# EAGLE design esp32_programmer (EAGLE 9.6.2)

## Sheet 1 of 4
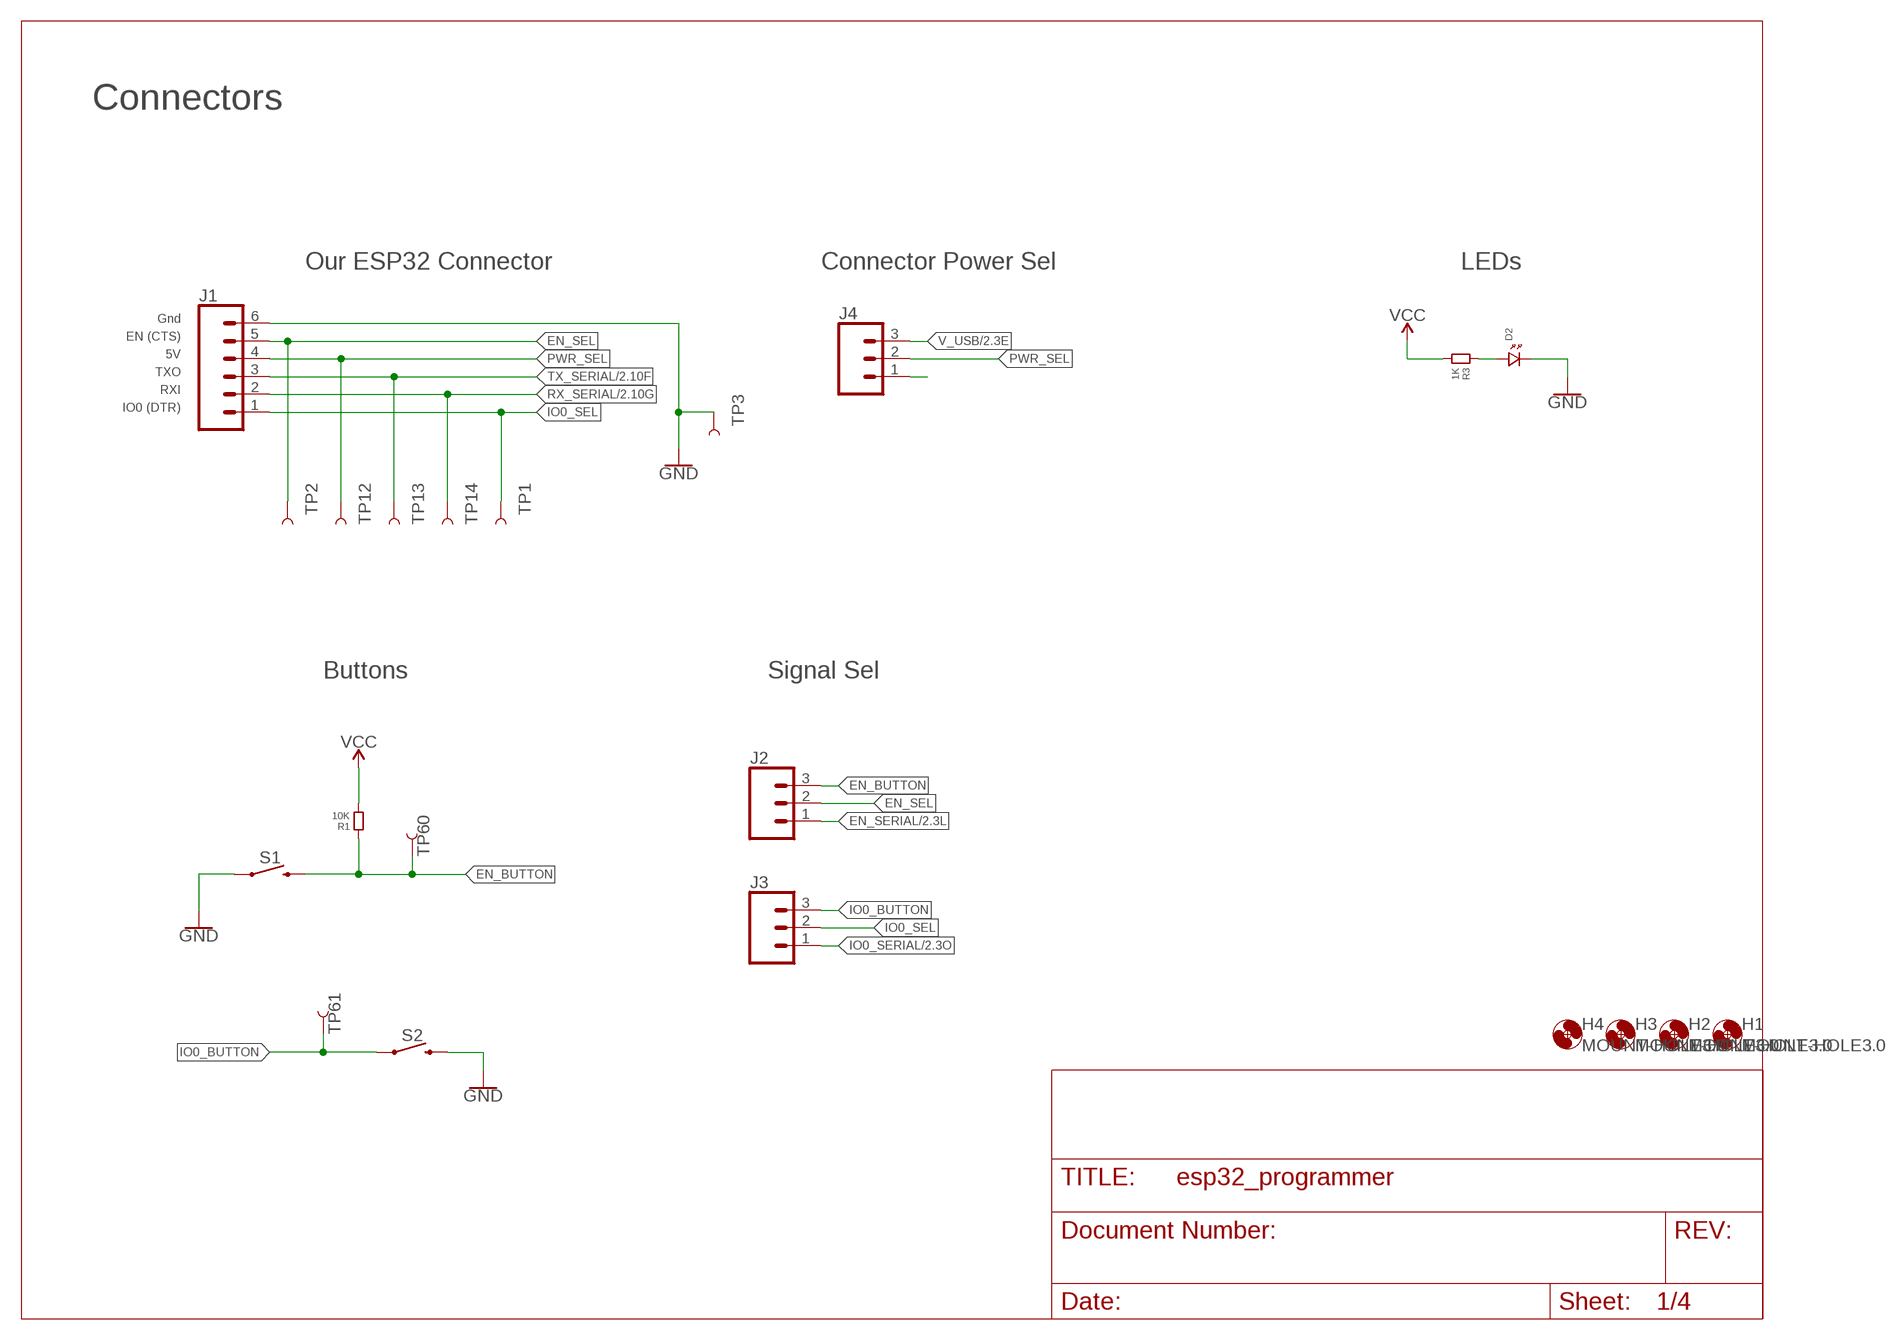
[diagram p0: schematic, sheet 1]

### Parts
D2  LED.1206  [1206.LED]
H1  MOUNT-HOLE3.0  [3,0]
H2  MOUNT-HOLE3.0  [3,0]
H3  MOUNT-HOLE3.0  [3,0]
H4  MOUNT-HOLE3.0  [3,0]
J1  CONN_06LONGPADS  [1X06_LONGPADS]
J2  CONN_03LONGPADS  [1X03_LONGPADS]
J3  CONN_03LONGPADS  [1X03_LONGPADS]
J4  CONN_03LONGPADS  [1X03_LONGPADS]
R1  10K  RESISTOR.1206  [1206]
R3  1K  RESISTOR.1206  [1206]
S1  MOMENTARY-SWITCH-SPST-SMD-5.2MM  [TACTILE_SWITCH_SMD_5.2MM]
S2  MOMENTARY-SWITCH-SPST-SMD-5.2MM  [TACTILE_SWITCH_SMD_5.2MM]
TP1  TEST-POINT3X5  [PAD.03X.05]
TP2  TEST-POINT3X5  [PAD.03X.05]
TP3  TEST-POINT3X5  [PAD.03X.05]
TP12  TEST-POINT3X5  [PAD.03X.05]
TP13  TEST-POINT3X5  [PAD.03X.05]
TP14  TEST-POINT3X5  [PAD.03X.05]
TP60  TEST-POINT3X5  [PAD.03X.05]
TP61  TEST-POINT3X5  [PAD.03X.05]

### Nets
EN_BUTTON: J2.3 R1.1 S1.3 TP60.P$1
EN_SEL: J1.5 J2.2 TP2.P$1
EN_SERIAL: J2.1 ; also sheet 2
GND: D2.P$2 J1.6 S1.1 S2.3 TP3.P$1 ; also sheet 2,3,4
IO0_BUTTON: J3.3 S2.1 TP61.P$1
IO0_SEL: J1.1 J3.2 TP1.P$1
IO0_SERIAL: J3.1 ; also sheet 2
N$8: J4.1
N$9: D2.P$1 R3.1
PWR_SEL [power]: J1.4 J4.2 TP12.P$1
RX_SERIAL: J1.2 TP14.P$1 ; also sheet 2,4
TX_SERIAL: J1.3 TP13.P$1 ; also sheet 2,4
V_USB [power]: J4.3 ; also sheet 2,3
VCC [power]: R1.2 R3.2 ; also sheet 2,3,4

### Notes on the sheet
- Connectors
- Our ESP32 Connector | Connector Power Sel | LEDs
- Gnd
- EN (CTS)
- 5V
- TXO
- RXI
- IO0 (DTR)
- Buttons | Signal Sel

## Sheet 2 of 4
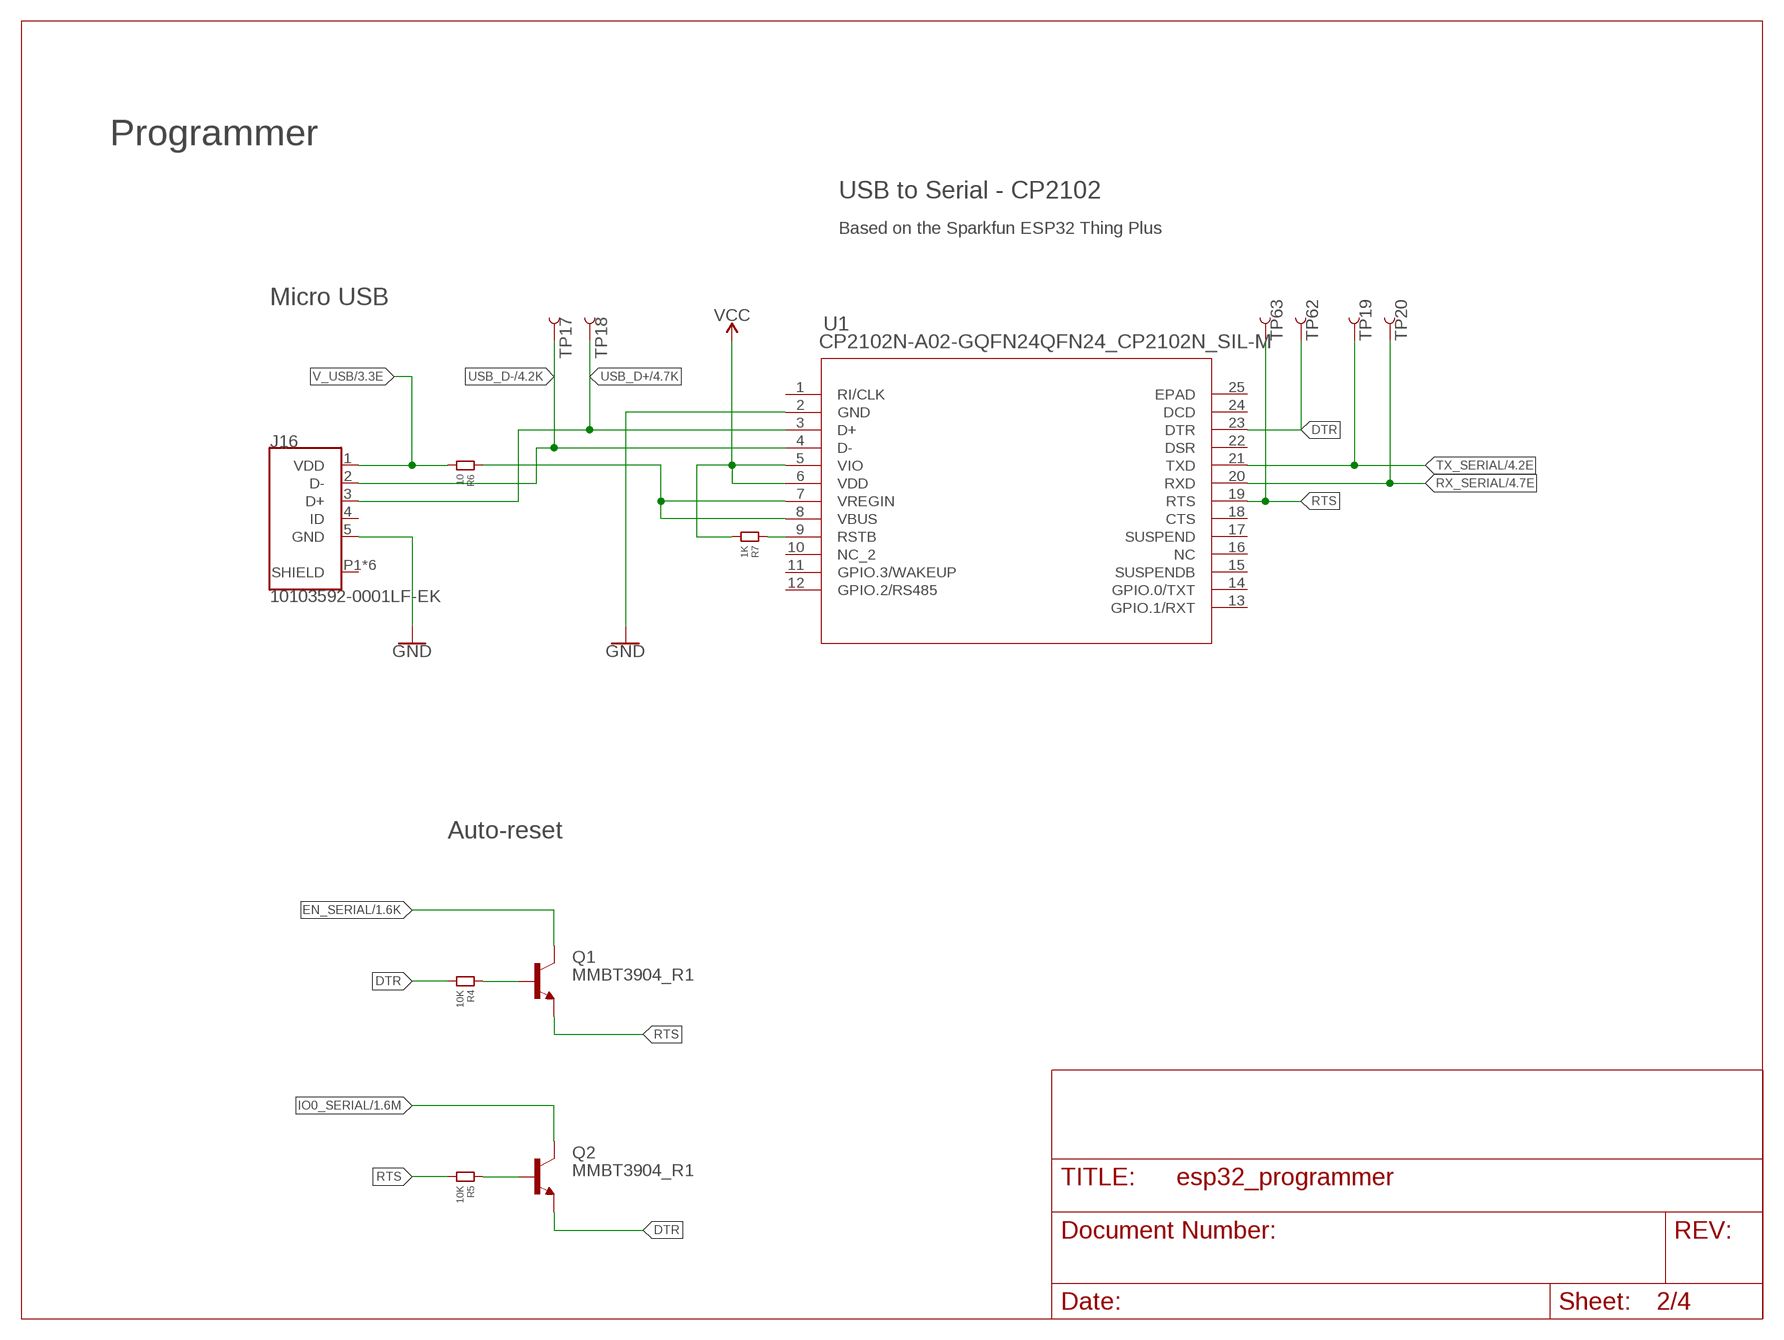
[diagram p1: schematic, sheet 2]

### Parts
J16  10103592-0001LF-EK  [AMPHENOL_10103592-0001LF]
Q1  MMBT3904_R1  BC846  [SOT23]
Q2  MMBT3904_R1  BC846  [SOT23]
R4  10K  RESISTOR.1206  [1206]
R5  10K  RESISTOR.1206  [1206]
R6  10  RESISTOR.1206  [1206]
R7  1K  RESISTOR.1206  [1206]
TP17  TEST-POINT3X5  [PAD.03X.05]
TP18  TEST-POINT3X5  [PAD.03X.05]
TP19  TEST-POINT3X5  [PAD.03X.05]
TP20  TEST-POINT3X5  [PAD.03X.05]
TP62  TEST-POINT3X5  [PAD.03X.05]
TP63  TEST-POINT3X5  [PAD.03X.05]
U1  CP2102N-A02-GQFN24QFN24_CP2102N_SIL-M  [QFN24_CP2102N_SIL-M]

### Nets
DTR: Q2.2(E) R4.2 TP62.P$1 U1.23(DTR)
EN_SERIAL: Q1.3(C) ; also sheet 1
GND: J16.5(GND) U1.2(GND) ; also sheet 1,3,4
IO0_SERIAL: Q2.3(C) ; also sheet 1
N$1: R6.1 U1.7(VREGIN) U1.8(VBUS)
N$10: Q1.1(B) R4.1
N$11: Q2.1(B) R5.1
N$12: R7.1 U1.9(RSTB)
RTS: Q1.2(E) R5.2 TP63.P$1 U1.19(RTS)
RX_SERIAL: TP20.P$1 U1.20(RXD) ; also sheet 1,4
TX_SERIAL: TP19.P$1 U1.21(TXD) ; also sheet 1,4
USB_D+: J16.3(D+) TP18.P$1 U1.3(D+) ; also sheet 4
USB_D-: J16.2(D-) TP17.P$1 U1.4(D-) ; also sheet 4
V_USB [power]: J16.1(VDD) R6.2 ; also sheet 1,3
VCC [power]: R7.2 U1.5(VIO) U1.6(VDD) ; also sheet 1,3,4
Unconnected: J16.4(ID) U1.1(RI/CLK) U1.10(NC_2) U1.11(GPIO.3/WAKEUP) U1.12(GPIO.2/RS485) U1.13(GPIO.1/RXT) U1.14(GPIO.0/TXT) U1.15(SUSPENDB) U1.16(NC) U1.17(SUSPEND) U1.18(CTS) U1.22(DSR) U1.24(DCD) U1.25(EPAD)

### Notes on the sheet
- Programmer
- USB to Serial - CP2102
- Based on the Sparkfun ESP32 Thing Plus
- Micro USB
- Auto-reset

## Sheet 3 of 4
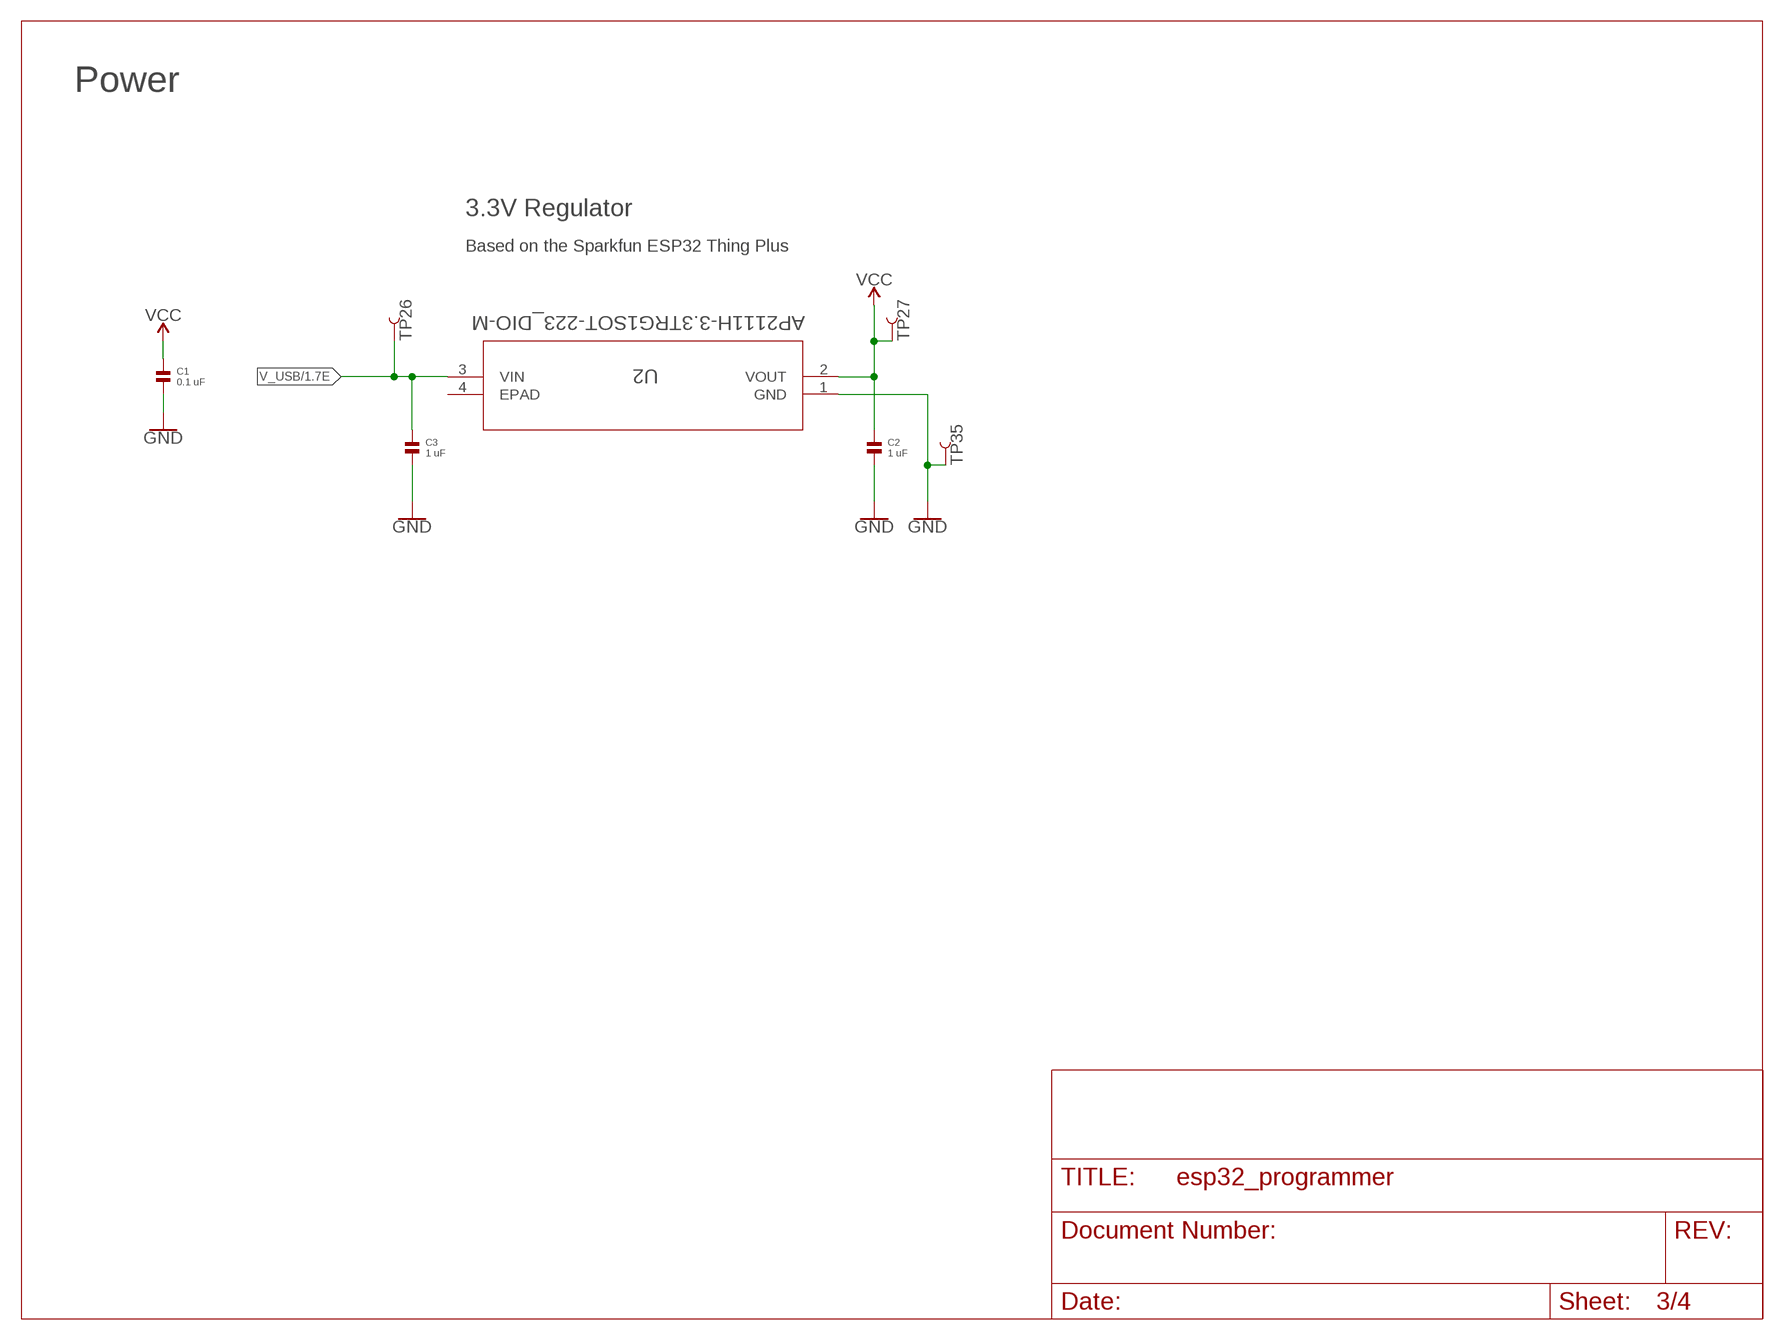
[diagram p2: schematic, sheet 3]

### Parts
C1  0.1 uF  CAPACITOR.1206  [1206]
C2  1 uF  CAPACITOR.1206  [1206]
C3  1 uF  CAPACITOR.1206  [1206]
TP26  TEST-POINT3X5  [PAD.03X.05]
TP27  TEST-POINT3X5  [PAD.03X.05]
TP35  TEST-POINT3X5  [PAD.03X.05]
U2  AP2111H-3.3TRG1SOT-223_DIO-M  [SOT-223_DIO-M]

### Nets
GND: C1.2 C2.2 C3.2 TP35.P$1 U2.1(GND) ; also sheet 1,2,4
V_USB [power]: C3.1 TP26.P$1 U2.3(VIN) ; also sheet 1,2
VCC [power]: C1.1 C2.1 TP27.P$1 U2.2(VOUT) ; also sheet 1,2,4
Unconnected: U2.4(EPAD)

### Notes on the sheet
- Power
- 3.3V Regulator
- Based on the Sparkfun ESP32 Thing Plus

## Sheet 4 of 4
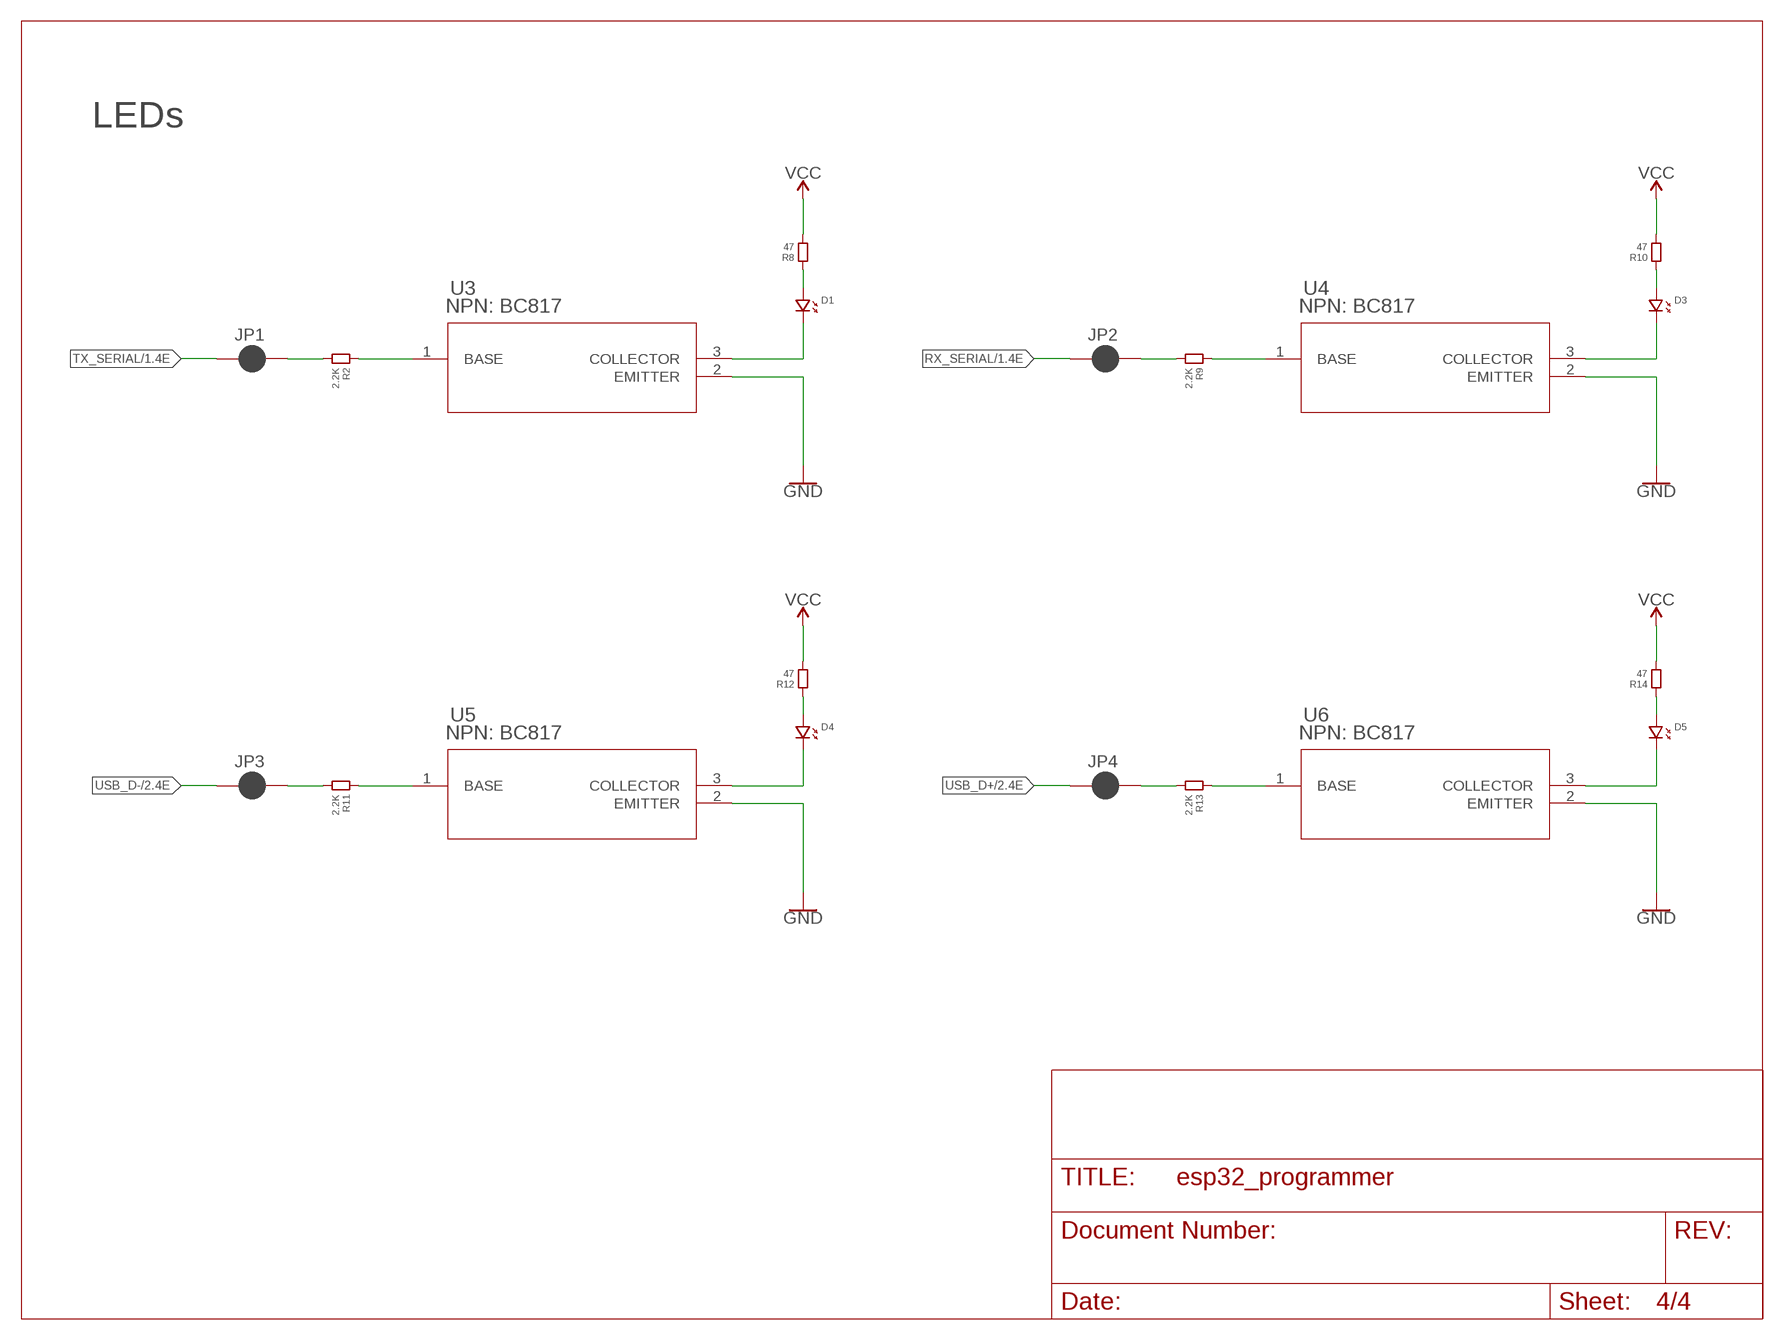
[diagram p3: schematic, sheet 4]

### Parts
D1  LED.1206  [1206.LED]
D3  LED.1206  [1206.LED]
D4  LED.1206  [1206.LED]
D5  LED.1206  [1206.LED]
JP1  JUMPER-SMT_2_NC_PASTE_SILK  [SMT-JUMPER_2_NC_PASTE_SILK]
JP2  JUMPER-SMT_2_NC_PASTE_SILK  [SMT-JUMPER_2_NC_PASTE_SILK]
JP3  JUMPER-SMT_2_NC_PASTE_SILK  [SMT-JUMPER_2_NC_PASTE_SILK]
JP4  JUMPER-SMT_2_NC_PASTE_SILK  [SMT-JUMPER_2_NC_PASTE_SILK]
R2  2.2K  RESISTOR.1206  [1206]
R8  47  RESISTOR.1206  [1206]
R9  2.2K  RESISTOR.1206  [1206]
R10  47  RESISTOR.1206  [1206]
R11  2.2K  RESISTOR.1206  [1206]
R12  47  RESISTOR.1206  [1206]
R13  2.2K  RESISTOR.1206  [1206]
R14  47  RESISTOR.1206  [1206]
U3  NPN: BC817  BC817-25LT3GSOT-23-3_1P4X3P040_ONS-M  [SOT-23-3_1P4X3P040_ONS-M]
U4  NPN: BC817  BC817-25LT3GSOT-23-3_1P4X3P040_ONS-M  [SOT-23-3_1P4X3P040_ONS-M]
U5  NPN: BC817  BC817-25LT3GSOT-23-3_1P4X3P040_ONS-M  [SOT-23-3_1P4X3P040_ONS-M]
U6  NPN: BC817  BC817-25LT3GSOT-23-3_1P4X3P040_ONS-M  [SOT-23-3_1P4X3P040_ONS-M]

### Nets
BLEP1: D4.P$2 U5.3(COLLECTOR)
BLEP2: D5.P$2 U6.3(COLLECTOR)
BLEP3: D1.P$2 U3.3(COLLECTOR)
BLEP4: D3.P$2 U4.3(COLLECTOR)
GND: U3.2(EMITTER) U4.2(EMITTER) U5.2(EMITTER) U6.2(EMITTER) ; also sheet 1,2,3
N$4: JP1.2 R2.2
N$7: JP2.2 R9.2
N$13: R2.1 U3.1(BASE)
N$14: D1.P$1 R8.1
N$15: R9.1 U4.1(BASE)
N$16: D3.P$1 R10.1
N$17: JP3.2 R11.2
N$18: R11.1 U5.1(BASE)
N$19: D4.P$1 R12.1
N$20: JP4.2 R13.2
N$21: R13.1 U6.1(BASE)
N$22: D5.P$1 R14.1
RX_SERIAL: JP2.1 ; also sheet 1,2
TX_SERIAL: JP1.1 ; also sheet 1,2
USB_D+: JP4.1 ; also sheet 2
USB_D-: JP3.1 ; also sheet 2
VCC [power]: R8.2 R10.2 R12.2 R14.2 ; also sheet 1,2,3

### Notes on the sheet
- LEDs

## Power pins joined to a net without a drawn wire
SHIELD: J16.P1(SHIELD) J16.P2(SHIELD) J16.P3(SHIELD) J16.P4(SHIELD) J16.P5(SHIELD) J16.P6(SHIELD)

## Library data of the parts
C1-C3 = standardparts:CAPACITOR
D1-D5 = standardparts:LED
H1-H4 = holes:MOUNT-HOLE: MOUNTING HOLE with drill center marker
J1 = zzzzSparkFun-Connectors:CONN_06: Multi connection point. Often used as Generic Header-pin footprint for 0.1 inch spaced/style header connections On any of the 0.1 inch spaced packages, you can populate with these: Break Away Headers - Straight <https://www.sparkfun.com/products/116> (PRT-00116) Break Away Male Headers - Right Angle <https://www.sparkfun.com/products/553> (PRT-00553) Female Headers <https://www.sparkfun.com/products/115> (PRT-00115) Break Away Headers - Machine Pin <https://www.sparkfun.com/products/117> (PRT-00117) Break Away Female Headers - Swiss Machine Pin <https://www.sparkfun.com/products/743> (PRT-00743) Arduino Stackable Header - 6 Pin <https://www.sparkfun.com/products/9280> (PRT-09280) For SCREWTERMINALS and SPRING TERMINALS visit here: Screw Terimnals on SparkFun.com <https://www.sparkfun.com/search/results?term=Screw+Terminals> (5mm/3.5mm/2.54mm spacing) This device is also useful as a general connection point to wire up your design to another part of your project. Our various solder wires solder well into these plated through hole pads. Hook-Up Wire - Assortment (Stranded, 22 AWG) <https://www.sparkfun.com/products/11375> (PRT-11375) Hook-Up Wire - Assortment (Solid Core, 22 AWG) <https://www.sparkfun.com/products/11367> (PRT-11367) View the entire wire category on our website here <https://www.sparkfun.com/categories/141>
J2-J4 = SparkFun-Connectors:CONN_03: Multi connection point. Often used as Generic Header-pin footprint for 0.1 inch spaced/style header connections On any of the 0.1 inch spaced packages, you can populate with these: Break Away Headers - Straight <https://www.sparkfun.com/products/116> (PRT-00116) Break Away Male Headers - Right Angle <https://www.sparkfun.com/products/553> (PRT-00553) Female Headers <https://www.sparkfun.com/products/115> (PRT-00115) Break Away Headers - Machine Pin <https://www.sparkfun.com/products/117> (PRT-00117) Break Away Female Headers - Swiss Machine Pin <https://www.sparkfun.com/products/743> (PRT-00743) Stackable Header - 3 Pin (Female, 0.1") <https://www.sparkfun.com/products/13875> (PRT-13875) For SCREWTERMINALS and SPRING TERMINALS visit here: Screw Terimnals on SparkFun.com <https://www.sparkfun.com/search/results?term=Screw+Terminals> (5mm/3.5mm/2.54mm spacing) This device is also useful as a general connection point to wire up your design to another part of your project. Our various solder wires solder well into these plated through hole pads. Hook-Up Wire - Assortment (Stranded, 22 AWG) <https://www.sparkfun.com/products/11375> (PRT-11375) Hook-Up Wire - Assortment (Solid Core, 22 AWG) <https://www.sparkfun.com/products/11367> (PRT-11367) View the entire wire category on our website here <https://www.sparkfun.com/categories/141> Special notes: Molex polarized connector foot print use with SKU : PRT-08232 with associated crimp pins and housings.
J16 = UltraLibrarianParts:10103592-0001LF-EK: Conn Micro USB Type B RCP 5 POS 0.65mm Solder RA SMD 5 Terminal 1 Port T/R; ARROW_ELECTRONICS-PURCHASE-URL: https://snapeda.com/shop?store=Arrow+Electronics&id=1274744; DESCRIPTION: USB - micro B USB 2.0 Receptacle Connector 5 Position Surface Mount, Right Angle; Through Hole; DIGI-KEY_PART_NUMBER: 609-4048-1-ND; DIGIKEY-PURCHASE-URL: https://snapeda.com/shop?store=DigiKey&id=1274744; MF: Amphenol ICC; MOUSER-PURCHASE-URL: https://snapeda.com/shop?store=Mouser&id=1274744; MP: 10103592-0001LF; PACKAGE: None
JP1-JP4 = SparkFun-Jumpers:JUMPER-SMT_2_NC_PASTE: Normally closed solder jumper This jumper has an aperture in the stencil to allow solder paste to bridge the split in the wire so it's normally closed (NC). Wick off the solder to open the connection. Reapply solder to reclose the connection.
Q1 Q2 = BC846:BC846: NPN TRANSISTOR Check availability <https://pricing.snapeda.com/parts/BC846/Rectron/view-part?ref=eda>; AVAILABILITY: In Stock; DESCRIPTION: Trans GP BJT NPN 65V 0.1A 3-Pin SOT-23; MF: Rectron; MP: BC846; PACKAGE: SOT-23-3 Rectron; PRICE: None
R1-R14 = standardparts:RESISTOR
S1 S2 = SparkFun-Switches:MOMENTARY-SWITCH-SPST: Momentary Switch (Pushbutton) - SPST Normally-open (NO) SPST momentary switches (buttons, pushbuttons). Variants PTH-12MM - 12mm square, through-hole Momentary Pushbutton Switch - 12mm Square <https://www.sparkfun.com/products/9190> (COM-09190) PTH-6.0MM, PTH-6.0MM-KIT - 6.0mm square, through-hole Mini Pushbutton Switch <https://www.sparkfun.com/products/97> (COM-00097) KIT package intended for soldering kit's - only one side of pads' copper is exposed. PTH-RIGHT-ANGLE-KIT - Right-angle, through-hole Right Angle Tactile Button <https://www.sparkfun.com/products/10791> - Used on SparkFun BigTime Watch Kit <https://www.sparkfun.com/products/11734> SMD-12MM - 12mm square, surface-mount Tactile Button - SMD (12mm) <https://www.sparkfun.com/products/12993> (COM-12993) Used on SparkFun PicoBoard <https://www.sparkfun.com/products/11888> SMD-4.5MM - 4.5mm Square Trackball Switch Used on SparkFun Blackberry Trackballer Breakout <https://www.sparkfun.com/products/13169> SMD-4.6MMX2.8MM - 4.60mm x 2.80mm, surface mount Used on SparkFun SAMD21 Mini Breakout <https://www.sparkfun.com/products/13664> SMD-5.2MM, SMD-5.2-REDUNDANT - 5.2mm square, surface-mount Mini Pushbutton Switch - SMD <https://www.sparkfun.com/products/8720> (COM-08720) Used on Arduino Pro Mini <https://www.sparkfun.com/products/11114> REDUNDANT package connects both switch circuits together SMD-6.0X3.5MM - 6.0 x 3.5mm, surface mount Momentary Reset Switch SMD <https://www.sparkfun.com/products/8229> (COM-08229) SMD-6.2MM-TALL - 6.2mm square, surface mount Tactile Button - SMD (6mm) <https://www.sparkfun.com/products/12992> Used on SparkFun Digital Sandbox <https://www.sparkfun.com/products/12651> SMD-RIGHT-ANGLE - Right-angle, surface mount Used on SparkFun Block for Intel® Edison - Arduino <https://www.sparkfun.com/products/13036>; PROD_ID: SWCH-08247; SF_SKU: COM-08720
TP1-TP3 TP12-TP14 TP17-TP20 TP26 TP27 TP35 TP60-TP63 = SparkFun-Connectors:TEST-POINT: SparkFun Test Points Bare copper test points for troubleshooting or In-Circuit-Testing. These are used by our Production team for verifying production board runs using pogo-pins on test beds. SparkFun Products: SparkFun LSM9DS1 Breakout <https://www.sparkfun.com/products/13284> SparkFun PSOC <https://www.sparkfun.com/products/13714> SparkFun Load Cell Amplifier <https://www.sparkfun.com/products/13879>
U1 = CP2102N-A02-GQFN24:CP2102N-A02-GQFN24; COPYRIGHT: Copyright (C) 2022 Ultra Librarian. All rights reserved.; DIGI-KEY_PART_NUMBER_1: 336-5887-ND; MANUFACTURER_PART_NUMBER: CP2102N-A02-GQFN24; MFR_NAME: Silicon Labs
U2 = AP2111H-3.3TRG1:AP2111H-3.3TRG1; COPYRIGHT: Copyright (C) 2022 Ultra Librarian. All rights reserved.; DIGI-KEY_PART_NUMBER_1: AP2111H-3.3TRG1DICT-ND; DIGI-KEY_PART_NUMBER_2: AP2111H-3.3TRG1DIDKR-ND; DIGI-KEY_PART_NUMBER_3: AP2111H-3.3TRG1DITR-ND; MANUFACTURER_PART_NUMBER: AP2111H-3.3TRG1; MFR_NAME: Diodes Inc
U3-U6 = UltraLibrarianParts:BC817-25LT3G; COPYRIGHT: Copyright (C) 2022 Ultra Librarian. All rights reserved.; DIGI-KEY_PART_NUMBER_1: BC817-25LT3GOSTR-ND; DIGI-KEY_PART_NUMBER_2: BC817-25LT3GOSCT-ND; DIGI-KEY_PART_NUMBER_3: BC817-25LT3GOSDKR-ND; DIGI-KEY_PART_NUMBER_4: 2156-BC817-25LT3G-OS-ND; MANUFACTURER_PART_NUMBER: BC817-25LT3G; MFR_NAME: onsemi

## Net classes
1 power: width 0.381 mm

## Board
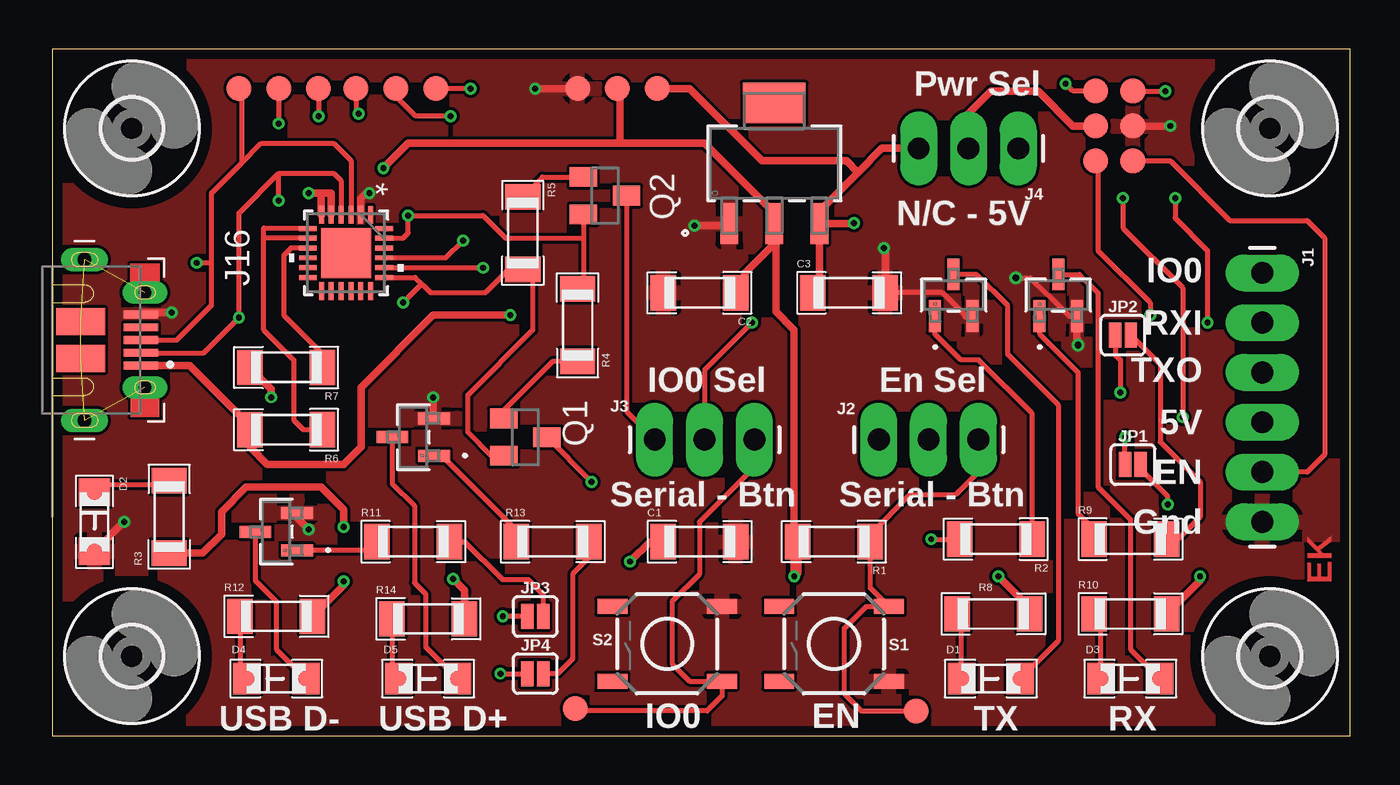
[diagram p4: board, top side]
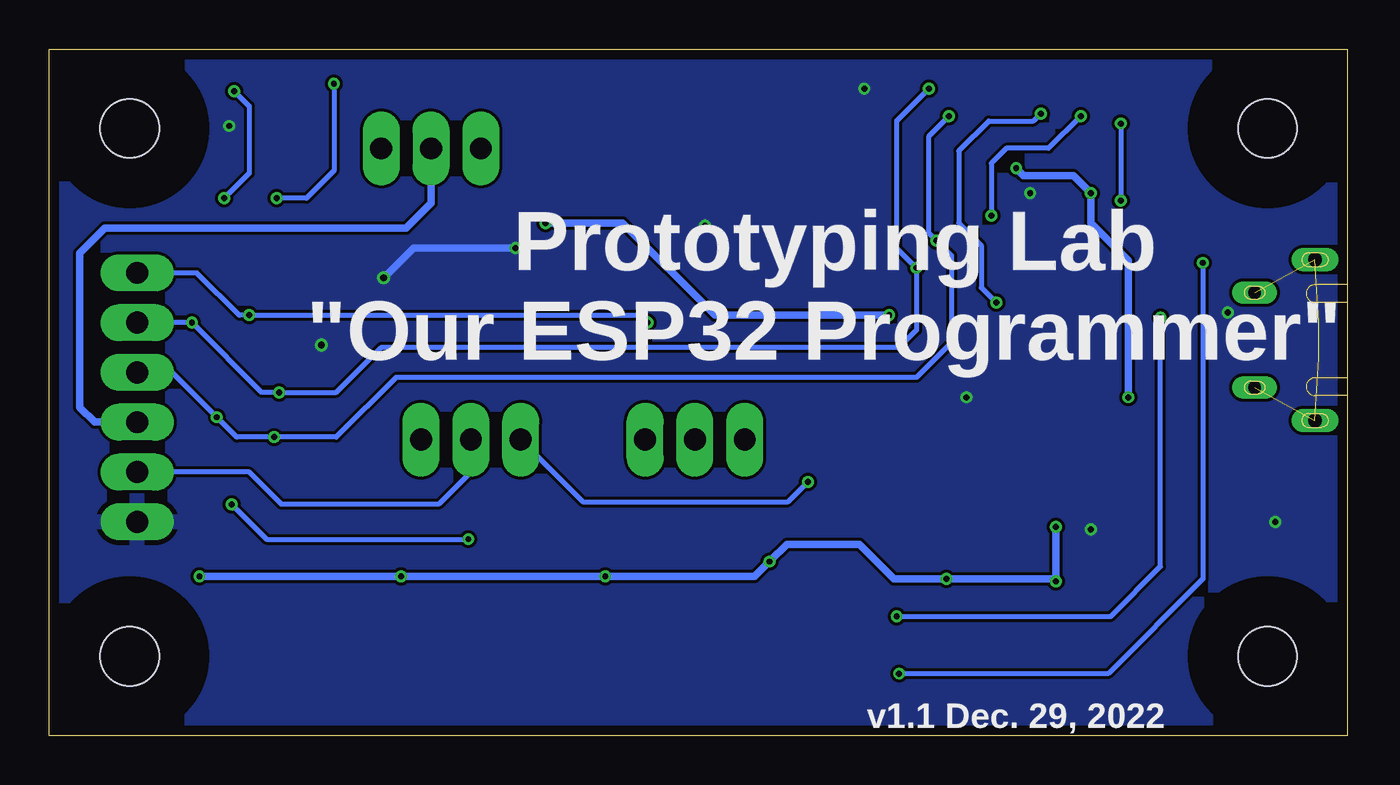
[diagram p5: board, bottom side, seen from below]

Size 66.22 x 35.04 mm. Coordinates in mm from the lower left corner, seen from the top.
Outline: 0,0 66.22,0 66.22,35.04 0,35.04 0,0
Copper layers (1*16): Top 0.035mm / dielectric 1.5mm / Bottom 0.035mm
Design rules "ek_pcbway_drc_dec27-22": minimum track width 6mil, minimum drill 0.3mm, track to track 6mil, track to pad 6mil, pad to pad 6mil, via to via 6mil, smd to smd 6mil, copper to edge 20mil, drill to drill 10mil, minimum pad ring 10mil, minimum via ring 6mil, stop-mask expansion 4mil, vias tented up to drill 0mil, thermal gap 10mil

### Footprints (pad centres in the part's own frame; a part is rotated, then mirrored left to right if it is on the bottom)
1206 = smd 1.3 x 1.8: 1 -1.85,0; 2 1.85,0
1206.LED = smd 1.4 x 1.6: P$1 -1.5,0; P$2 1.5,0
3,0 = hole 3: 0,0
1X06_LONGPADS = drill 1.118 pad 1.88 long: 1 0,0; 2 2.54,0; 3 5.08,0; 4 7.62,0; 5 10.16,0; 6 12.7,0
1X03_LONGPADS = drill 1.118 pad 1.88 long: 1 0,0; 2 2.54,0; 3 5.08,0
AMPHENOL_10103592-0001LF = smd 0.4 x 1.75: 1 1.3,2.875; 2 0.65,2.875; 3 0,2.875; 4 -0.65,2.875; 5 -1.3,2.875 | drill 0.65 pad 0.8 long: P1 -2.425,3.08; P2 2.425,3.08 | drill 0.7 pad 1.05 long: P3 -4.1,0; P6 4.1,0 | smd 1.375 x 2.5: P4 -0.938,-0.2; P5 0.938,-0.2
SMT-JUMPER_2_NC_PASTE_SILK = smd 0.635 x 1.27: 1 -0.406,0; 2 0.406,0
SOT23 = smd 1 x 1.4: 1 -0.95,-1.1; 2 0.95,-1.1; 3 0,1.1
TACTILE_SWITCH_SMD_5.2MM = smd 1.524 x 0.762: 1 -2.794,1.905; 2 2.794,1.905; 3 -2.794,-1.905; 4 2.794,-1.905
PAD.03X.05 = smd 1.27 x 1.27: P$1 0,0
QFN24_CP2102N_SIL-M = smd 0.914 x 0.254: 1 -1.943,1.25; 2 -1.943,0.75; 3 -1.943,0.25; 4 -1.943,-0.25; 5 -1.943,-0.75; 6 -1.943,-1.25; 13 1.943,-1.25; 14 1.943,-0.75; 15 1.943,-0.25; 16 1.943,0.25; 17 1.943,0.75; 18 1.943,1.25 | smd 0.254 x 0.914: 7 -1.25,-1.943; 8 -0.75,-1.943; 9 -0.25,-1.943; 10 0.25,-1.943; 11 0.75,-1.943; 12 1.25,-1.943; 19 1.25,1.943; 20 0.75,1.943; 21 0.25,1.943; 22 -0.25,1.943; 23 -0.75,1.943; 24 -1.25,1.943 | smd 2.54 x 2.54: 25 0,0
SOT-223_DIO-M = smd 0.902 x 2.066: 1 -2.3,-3.076; 2 0,-3.076; 3 2.3,-3.076 | smd 3.202 x 2.066: 4 0,3.076
SOT-23-3_1P4X3P040_ONS-M = smd 0.61 x 1.626: 1 -0.953,-1.067; 2 0.953,-1.067; 3 0,1.067

### Placement (x,y rotation side)
C1  33.02,9.91 0 top
C2  33.02,22.61 180 top
C3  40.64,22.61 0 top
D1  47.88,2.92 0 top
D2  2.16,10.92 270 top
D3  54.99,2.92 0 top
D4  11.43,2.92 0 top
D5  19.18,2.92 0 top
H1  62.1,30.99 0 top
H2  62.1,4.06 0 top
H3  4.06,30.99 0 top
H4  4.06,4.06 0 top
J1  61.72,23.62 270 top
J2  42.16,15.11 0 top
J3  30.73,15.11 0 top
J4  49.28,29.97 180 top
J16  1.65,20.19 270 top
JP1  55.12,13.84 0 top
JP2  54.61,20.45 0 top
JP3  24.64,6.1 0 top
JP4  24.64,3.17 0 top
Q1  24.13,15.24 270 top
Q2  28.19,27.56 270 top
R1  39.88,9.91 180 top
R2  48.13,10.03 180 top
R3  5.97,11.18 270 top
R4  26.8,20.95 90 top
R5  24,25.65 270 top
R6  11.94,15.62 180 top
R7  11.94,18.8 180 top
R8  48.01,6.22 0 top
R9  54.99,10.03 0 top
R10  54.99,6.22 0 top
R11  18.41,9.91 0 top
R12  11.43,6.1 0 top
R13  25.53,9.91 0 top
R14  19.18,5.97 0 top
S1  39.88,4.7 180 top
S2  31.37,4.7 180 top
TP1  53.21,29.34 0 top
TP2  55.12,29.34 0 top
TP3  55.12,31.11 0 top
TP12  53.21,31.11 180 top
TP13  53.21,32.89 180 top
TP14  55.12,32.89 180 top
TP17  11.56,33.02 0 top
TP18  9.53,33.02 0 top
TP19  17.53,33.02 0 top
TP20  19.56,33.02 0 top
TP26  30.86,33.02 90 top
TP27  28.83,33.02 90 top
TP35  26.8,33.02 90 top
TP60  44.07,1.27 0 top
TP61  26.67,1.4 0 top
TP62  13.59,33.02 0 top
TP63  15.49,33.02 0 top
U1  14.99,24.64 270 top
U2  36.83,29.21 0 top
U3  45.97,22.48 0 top
U4  51.31,22.48 0 top
U5  11.43,10.41 90 top
U6  18.41,15.24 90 top

### Tracks (layer width: path | path; a pad name or v marks a point on that pad's centre or on a via)
BLEP1
  Top 0.254: D4.P$2 11.43,4.42 11.43,6.86 10.36,7.92 U5.3
BLEP2
  Top 0.254: D5.P$2 19.05,4.55 19.05,7.24 18.48,7.81 18.48,11.75 17.35,12.88 U6.3
BLEP3
  Top 0.254: D1.P$2 51.31,4.85 51.31,16.89 48.74,19.46 48.74,21.94 47.13,23.55 U3.3
BLEP4
  Top 0.254: D3.P$2 54.99,4.42 54.99,11.05 53.34,12.7 53.34,22.61 52.4,23.55 U4.3
DTR  (via drill 0.3)
  Top 0.254: Q2.2 27.09,25.4 | 27.09,25.4 27.09,23.1 R4.2 | U1.23 17.89,25.39 18.16,25.65 v18.16,26.54 21.97,26.54 23.11,25.4 27.09,25.4 | TP62.P$1 v13.59,31.62
  Bottom 0.254: v13.59,31.62 15.24,29.97 17.4,29.97 18.16,29.21 v18.16,26.54
EN_BUTTON
  Top 0.254: J2.3 47.24,13.46 46.1,12.32 43.76,12.32 41.73,10.29 R1.1 41.73,7.55 S1.3 41.53,6.6 40.39,5.46 40.39,2.16 41.27,1.27 TP60.P$1
EN_SEL
  Top 0.254: TP2.P$1 57.02,29.34 60.07,26.29 64.01,26.29 64.9,25.4 64.9,14.35 64.01,13.46 J1.5
  Bottom 0.254: J2.2 44.7,13.46 46.35,11.81 54.36,11.81 56.01,13.46 J1.5
EN_SERIAL  (via drill 0.3)
  Top 0.254: v27.52,12.95 Q1.3
  Bottom 0.254: v27.52,12.95 28.53,11.94 38.99,11.94 J2.1
GND  (via drill 0.3, 0.35)
  Top 0.254: 46.59,21.41 45.4,22.61 C3.2 | v49.15,23.37 49.9,23.37 50.76,22.5 50.78,22.5 51.87,21.41 U4.2
  Top 0.381: TP3.P$1 v57.02,31.11 | J16.5 4.62,21.59 v6.1,21.59 | D2.P$2 3.66,10.92 v3.68,10.92 | v13.08,10.54 12.5,11.12 U5.2 | U6.2 19.43,16.24 v19.43,17.27 | U1.2 15.74,27.42 16,27.69 v16.18,27.69 | C3.2 42.49,24.82 v42.42,24.89 | U3.2 46.59,21.41 | U2.1 34.43,26.04 v32.77,26.04 | TP35.P$1 v24.64,33.02 | U4.2 52.26,20.26 52.32,20.19 v52.32,19.94
  Bottom 0.381: v42.42,24.89 47.62,24.89 v49.15,23.37
  pour Top: -3.81,38.1 -3.81,-2.54 69.85,-2.54 69.85,38.1
  pour Bottom: -2.54,36.83 -2.54,-1.27 68.58,-1.27 68.58,36.83
IO0_BUTTON
  Top 0.254: J3.3 35.81,13.72 33.01,10.91 33.01,8.24 31.62,6.86 31.62,3.68 32.51,2.79 S2.1 34.16,2.03 33.4,1.27 26.8,1.27 TP61.P$1
IO0_SEL  (via drill 0.3)
  Top 0.254: v35.69,21.08 33.27,18.67 J3.2 | TP1.P$1 53.34,29.21 53.34,24.77 56.01,22.1 v56.01,21.46
  Bottom 0.254: J1.1 58.67,23.62 56.52,21.46 v56.01,21.46 36.07,21.46 v35.69,21.08
IO0_SERIAL
  Top 0.254: J3.1 29.29,16.55 Q2.3
N$1
  Top 0.254: U1.7 13.02,25.91 10.79,25.91 10.79,25.39 | 10.79,25.39 10.79,20.7 12.32,19.18 12.32,16.11 12.81,15.62 R6.1 | U1.8 10.79,25.39
N$4  (via drill 0.3)
  Top 0.254: v44.83,10.03 R2.2 | v56.9,11.81 56.9,12.22 55.52,13.59 JP1.2
  Bottom 0.254: v56.9,11.81 55.12,10.03 v44.83,10.03
N$7
  Top 0.254: JP2.2 56.52,18.95 56.52,14.99 58.55,12.95 58.55,11.18 57.4,10.03 R9.2
N$9
  Top 0.254: R3.1 5.75,12.8 2.54,12.8 D2.P$1
N$10
  Top 0.254: Q1.1 23.03,16.61 25.53,19.11 R4.1
N$11
  Top 0.254: R5.1 25.01,28.51 Q2.1
N$12
  Top 0.254: U1.9 12.19,24.89 11.81,24.51 11.81,21.46 13.84,19.43 13.84,18.85 R7.1
N$13
  Top 0.254: R2.1 49.98,16.44 47.24,19.18 46.35,19.18 45.02,20.51 U3.1
N$14
  Top 0.254: D1.P$1 46.38,6 R8.1
N$15
  Top 0.254: R9.1 53.14,10.54 52.32,11.36 52.32,18.54 50.35,20.51 U4.1
N$16
  Top 0.254: D3.P$1 53.49,5.87 R10.1
N$17
  Top 0.254: R11.2 21.03,9.91 22.96,7.97 24.29,7.97 25.04,7.21 JP3.2
N$18
  Top 0.254: R11.1 16.12,9.46 U5.1
N$19
  Top 0.254: R12.1 9.58,3.27 D4.P$1
N$20
  Top 0.254: JP4.2 25.78,3.17 26.54,3.94 26.54,8.26 27.24,8.95 27.38,9.09 R13.2
N$21
  Top 0.254: R13.1 23.68,10.49 19.81,14.35 19.65,14.35 U6.1
N$22
  Top 0.254: R14.1 17.33,3.27 D5.P$1
PWR_SEL
  Top 0.381: J4.2 46.74,31.75 47.88,32.89 50.29,32.89 52.07,31.11 TP12.P$1
  Bottom 0.381: J1.4 63.88,16 64.64,16.76 64.64,24.64 63.37,25.91 48.01,25.91 46.74,27.18 J4.2
RTS  (via drill 0.3)
  Top 0.254: Q1.2 22.41,14.29 21.21,15.49 21.21,17.4 24.51,20.7 24.51,23.3 R5.2 23.3,23.8 22.1,22.61 19.3,22.61 18.92,22.99 | U1.19 18.52,23.39 18.92,22.99 | TP63.P$1 15.49,31.88 v15.62,31.75 | v17.91,22.1 18.8,22.99 18.92,22.99
  Bottom 0.254: v15.62,31.75 16,31.37 18.29,31.37 19.81,29.84 19.81,26.16 18.67,25.02 18.67,22.86 v17.91,22.1
RX_SERIAL  (via drill 0.3)
  Top 0.254: v21.97,23.88 21.96,23.89 U1.20 | JP2.1 54.23,20.42 54.23,19.43 54.48,19.18 v54.48,17.53 | v21.34,33.02 TP20.P$1 | TP14.P$1 v56.77,32.89 | v57.28,27.43 57.28,26.42 58.93,24.77 v58.93,21.08
  Bottom 0.254: J1.2 v58.93,21.08 55.37,17.53 v54.48,17.53 51.56,17.53 49.28,19.81 22.86,19.81 21.97,20.7 v21.97,23.88 22.99,24.89 22.99,31.37 v21.34,33.02 | v56.77,32.89 56.01,32.13 56.01,28.7 v57.28,27.43
SHIELD  (5 unrouted)
TX_SERIAL  (via drill 0.3)
  Top 0.254: U1.21 20.06,24.39 v20.95,25.27 | JP1.1 54.71,15.21 v54.74,15.24 | TP19.P$1 17.53,32.64 18.54,31.62 v20.32,31.62 | TP13.P$1 52.07,32.89 v51.69,33.27 | v57.66,16.26 57.66,22.86 54.61,25.91 v54.61,27.43
  Bottom 0.254: J1.3 59.94,18.54 v57.66,16.26 56.64,15.24 v54.74,15.24 51.56,15.24 48.51,18.29 21.97,18.29 20.19,20.07 20.19,24.51 v20.95,25.27 21.34,25.65 21.34,30.61 v20.32,31.62 | v51.69,33.27 51.69,28.83 53.09,27.43 v54.61,27.43
USB_D+  (via drill 0.3)
  Top 0.254: J16.3 6.35,20.19 8.13,21.97 8.13,24.13 | U1.3 15.24,29.34 14.35,30.23 10.67,30.23 9.65,29.21 | 8.13,24.13 8.13,27.69 9.65,29.21 | 8.13,24.13 v7.37,24.13 | v22.86,3.17 JP4.1 | TP18.P$1 9.65,32.89 9.65,29.21
  Bottom 0.254: v7.37,24.13 7.37,8 12.19,3.17 v22.86,3.17
USB_D-  (via drill 0.3)
  Top 0.254: J16.2 7.73,19.54 v9.53,21.34 9.53,26.67 11.56,28.7 | 11.56,28.7 14.35,28.7 14.74,28.32 U1.4 | JP3.1 v22.99,6.1 | TP17.P$1 v11.56,31.24 | v11.56,27.3 11.56,28.7
  Bottom 0.254: v22.99,6.1 12.06,6.1 9.53,8.64 v9.53,21.34 | v11.56,31.24 v11.56,27.3
V_USB  (via drill 0.3)
  Top 0.381: J16.1 7.01,18.89 10.09,15.82 R6.2 10.09,14.73 10.98,13.84 14.86,13.84 15.75,14.73 15.75,17.78 19.43,21.46 v23.37,21.46 | C3.1 39.13,22.95 U2.3 | v40.89,26.16 40.87,26.13 U2.3 | 41.1,28.75 42.33,29.97 J4.3 | 41.1,28.75 39.13,26.77 U2.3 | TP26.P$1 32.51,33.02 36.2,29.34 40.51,29.34 41.1,28.75
  Bottom 0.381: v23.37,21.46 32.26,21.46 36.96,26.16 v40.89,26.16
VCC  (via drill 0.3)
  Top 0.381: 36.83,25.12 U2.2 36.83,26.67 33.27,30.23 28.96,30.23 | 36.83,25.12 36.91,25.2 36.91,21.65 37.85,20.72 v37.85,8.13 38.03,8.31 R1.2 | 36.83,25.12 35.31,23.59 35.31,23.04 C2.1 | U1.5 14.22,26.59 14.22,27.69 13.72,27.69 | U1.6 13.72,26.6 13.72,27.69 | 13.72,27.69 v13.08,27.69 | 28.96,30.23 18.16,30.23 v16.89,28.96 | C1.1 30.48,9.91 v29.46,8.89 | R8.2 49.86,6.53 v48.26,8.13 | v58.55,8.13 58.55,7.93 R10.2 | R12.2 14.86,7.67 v14.86,7.87 | R14.2 21.03,7.42 v20.45,8 | R3.2 7.67,9.33 8.64,10.29 8.64,11.43 9.91,12.7 13.72,12.7 14.86,11.56 v14.86,10.67 | R7.2 11.18,17.71 v11.18,17.27 | TP27.P$1 28.96,32.89 28.96,30.23
  Bottom 0.381: v16.89,28.96 16.51,28.57 13.97,28.57 v13.08,27.69 13.08,26.16 11.18,24.26 v11.18,17.27 | v58.55,8.13 v48.26,8.13 v37.85,8.13 30.23,8.13 v29.46,8.89 28.57,9.78 24.89,9.78 23.11,8 v20.45,8 14.99,8 v14.86,7.87 v14.86,10.67

### Text on the board
Top: EK
tNames: Pwr Sel | N/C - 5V | IO0 | RXI | IO0 Sel | En Sel | TXO | 5V | EN | Serial - Btn | Serial - Btn | Gnd | USB D- | USB D+ | IO0 | EN | TX | RX
bNames: Prototyping Lab | "Our ESP32 Programmer" | v1.1 Dec. 29, 2022